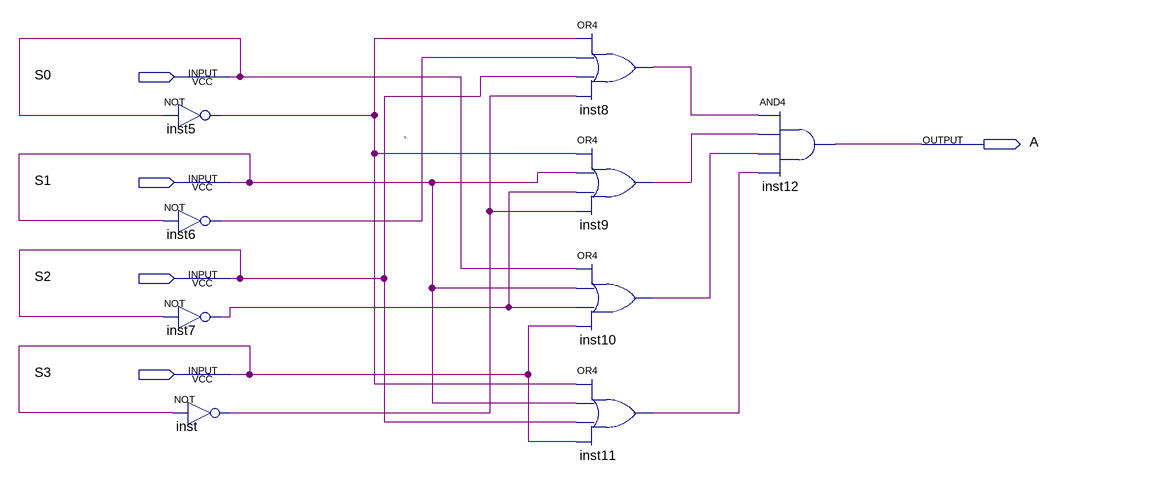
[diagram p0: schematic sheet]
// Quartus schematic A-nda2_3.bdf as structural Verilog: 9 symbols, 5 pins
module \A-nda2_3  (
  input  S0,
  input  S1,
  input  S2,
  input  S3,
  output A
);

  wire inst5_out, inst6_out, inst7_out, inst8_out, inst9_out, inst10_out, inst11_out, inst_out;

  not inst5 (inst5_out, S0);
  not inst6 (inst6_out, S1);
  not inst7 (inst7_out, S2);
  not inst (inst_out, S3);
  or inst8 (inst8_out, inst5_out, inst6_out, S2, inst_out);
  or inst9 (inst9_out, inst5_out, S1, inst7_out, inst_out);
  or inst10 (inst10_out, S0, S1, inst7_out, S3);
  or inst11 (inst11_out, inst5_out, S1, S2, S3);
  and inst12 (A, inst8_out, inst9_out, inst10_out, inst11_out);

  // Notes on the sheet:
  //   `
endmodule
